# Altium schematic sheet Mutisheet.SchDoc
size B
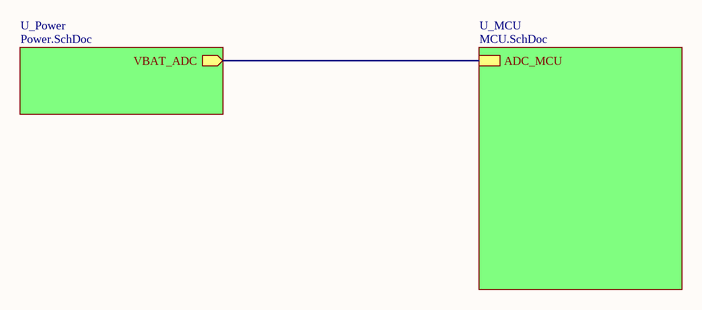
[diagram p0: Mutisheet.SchDoc]

## Sub-sheets
U_MCU = MCU.SchDoc: ADC_MCU
U_Power = Power.SchDoc: VBAT_ADC (out)

## Nets
(unnamed): sheet U_MCU/ADC_MCU, sheet U_Power/VBAT_ADC